# Altium schematic sheet ISO7240F.SchDoc: ISOLATION
size A; DrawnBy: Mr. Thach; Revision: Rev 1.0
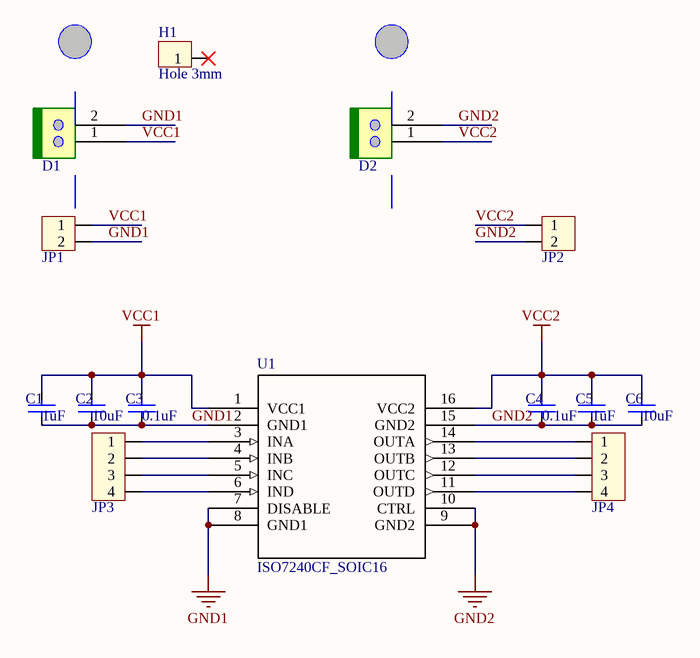
[diagram p0: ISO7240F.SchDoc]

## Parts
C1  1uF  [0805_C]
C2  10uF  [0805_C]
C3  0.1uF  [0805_C]
C4  0.1uF  [0805_C]
C5  1uF  [0805_C]
C6  10uF  [0805_C]
D1  DOMINO  [DOMINO2]  (value not drawn)
D2  DOMINO  [DOMINO2]  (value not drawn)
H1  Hole 3mm  [Hole_3mm]
JP1  JP2  [HEAD2]  (value not drawn)
JP2  JP2  [HEAD2]  (value not drawn)
JP3  JP4  [HEAD4]  (value not drawn)
JP4  JP4  [HEAD4]  (value not drawn)
U1  ISO7240CF_SOIC16  [DW16_ISO7240CF]

## Nets
GND1: C1.1 C2.1 C3.1 D1.2 JP1.2 U1.2(GND1) U1.7(DISABLE) U1.8(GND1)
GND2: C4.1 C5.1 C6.1 D2.2 JP2.2 U1.9(GND2) U1.10(CTRL) U1.15(GND2)
VCC1: C1.2 C2.2 C3.2 D1.1 JP1.1 U1.1(VCC1)
VCC2: C4.2 C5.2 C6.2 D2.1 JP2.1 U1.16(VCC2)
NetJP3_1: JP3.1 U1.3(INA)
NetJP3_2: JP3.2 U1.4(INB)
NetJP3_3: JP3.3 U1.5(INC)
NetJP3_4: JP3.4 U1.6(IND)
NetJP4_1: JP4.1 U1.14(OUTA)
NetJP4_2: JP4.2 U1.13(OUTB)
NetJP4_3: JP4.3 U1.12(OUTC)
NetJP4_4: JP4.4 U1.11(OUTD)

Not connected (* = marked no-connect by the designer): H1 1*

## Library data of the parts
C1-C6 = 0805_C: 0805 SMD capacitor
D1 D2 = Domino2_5mm
H1 = Hole_3mm
JP1 JP2 = HEAD2: Connector 2; Value: Connector 2
JP3 JP4 = HEAD4: Connector 4; Value: Connector 4